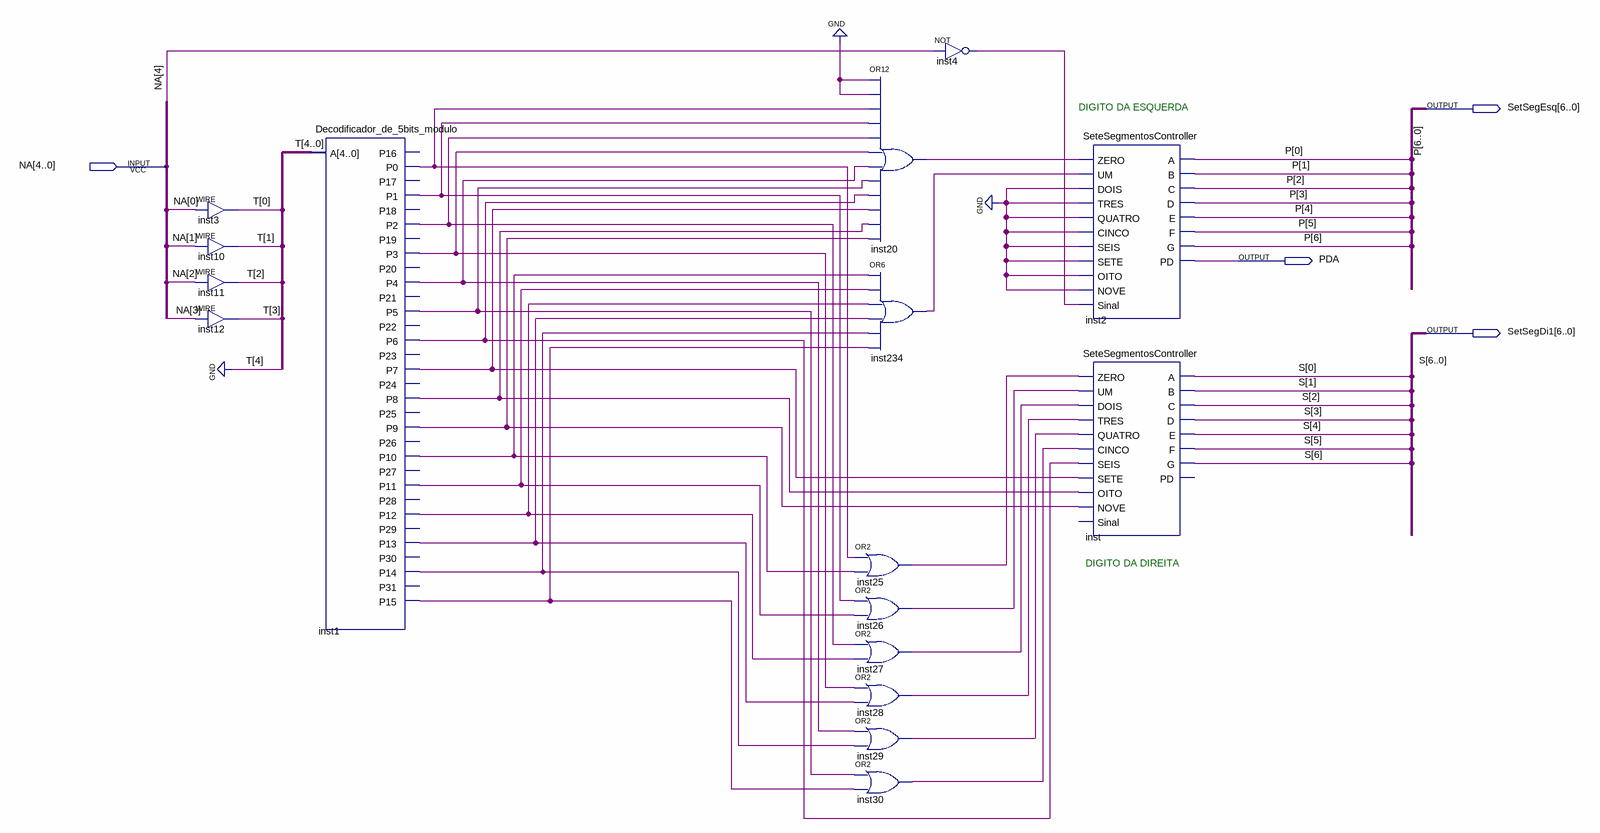
[diagram p0: schematic sheet]
// Quartus schematic AB_SeteSegmentos.bdf as structural Verilog: 16 symbols, 4 pins
module AB_SeteSegmentos (
  input  [4:0] NA,
  output [6:0] SetSegEsq,
  output PDA,
  output [6:0] SetSegDi1
);

  wire inst1_p0, inst1_p1, inst1_p2, inst1_p3, inst1_p4, inst1_p5, inst1_p6, inst1_p7, inst1_p8, inst1_p9,
       inst1_p10, inst1_p11, inst1_p12, inst1_p13, inst1_p14, inst1_p15, inst4_out, inst20_out, inst25_out,
       inst26_out, inst27_out, inst28_out, inst29_out, inst30_out, inst234_out;
  wire [3:0] T;

  assign T[0] = NA[0];  // WIRE inst3
  assign T[1] = NA[1];  // WIRE inst10
  assign T[2] = NA[2];  // WIRE inst11
  assign T[3] = NA[3];  // WIRE inst12
  Decodificador_de_5bits_modulo inst1 (
    .A({1'b0, T}), .P0(inst1_p0), .P1(inst1_p1), .P2(inst1_p2), .P3(inst1_p3), .P4(inst1_p4), .P5(inst1_p5),
    .P6(inst1_p6), .P7(inst1_p7), .P8(inst1_p8), .P9(inst1_p9), .P10(inst1_p10), .P11(inst1_p11),
    .P12(inst1_p12), .P13(inst1_p13), .P14(inst1_p14), .P15(inst1_p15));  // open: P16, P17, P18, P19, P20, P21, P22, P23, P24, P25, P26, P27, P28, P29, P30, P31
  or inst20 (inst20_out, 1'b0, 1'b0, inst1_p0, inst1_p1, inst1_p2, inst1_p3, inst1_p4, inst1_p5, inst1_p6, inst1_p7, inst1_p8, inst1_p9);
  or inst234 (inst234_out, inst1_p10, inst1_p11, inst1_p12, inst1_p13, inst1_p14, inst1_p15);
  or inst25 (inst25_out, inst1_p0, inst1_p10);
  or inst26 (inst26_out, inst1_p1, inst1_p11);
  or inst27 (inst27_out, inst1_p2, inst1_p12);
  or inst28 (inst28_out, inst1_p3, inst1_p13);
  or inst29 (inst29_out, inst1_p4, inst1_p14);
  or inst30 (inst30_out, inst1_p5, inst1_p15);
  not inst4 (inst4_out, NA[4]);
  SeteSegmentosController inst2 (
    .ZERO(inst20_out), .UM(inst234_out), .DOIS(1'b0), .TRES(1'b0), .QUATRO(1'b0), .CINCO(1'b0), .SEIS(1'b0),
    .SETE(1'b0), .OITO(1'b0), .NOVE(1'b0), .Sinal(inst4_out), .A(SetSegEsq[0]), .B(SetSegEsq[1]),
    .C(SetSegEsq[2]), .D(SetSegEsq[3]), .E(SetSegEsq[4]), .F(SetSegEsq[5]), .G(SetSegEsq[6]), .PD(PDA));
  SeteSegmentosController inst (
    .ZERO(inst25_out), .UM(inst26_out), .DOIS(inst27_out), .TRES(inst28_out), .QUATRO(inst29_out),
    .CINCO(inst30_out), .SEIS(inst1_p6), .SETE(inst1_p7), .OITO(inst1_p8), .NOVE(inst1_p9), .A(SetSegDi1[0]),
    .B(SetSegDi1[1]), .C(SetSegDi1[2]), .D(SetSegDi1[3]), .E(SetSegDi1[4]), .F(SetSegDi1[5]), .G(SetSegDi1[6]));  // open: Sinal, PD

  // Other names for the same wires on the sheet: S[6:0] = SetSegDi1; P[6:0] = SetSegEsq

  // Notes on the sheet:
  //   DIGITO DA ESQUERDA
  //   DIGITO DA DIREITA
endmodule
